# Altium schematic sheet 7segment.SchDoc: 7 szegmens kijelzők
size A4; Author: Debreczeni László; Organization: BME-AUT; DocumentNumber: 2; Revision: A27; SheetNumber: 2; SheetTotal: 5
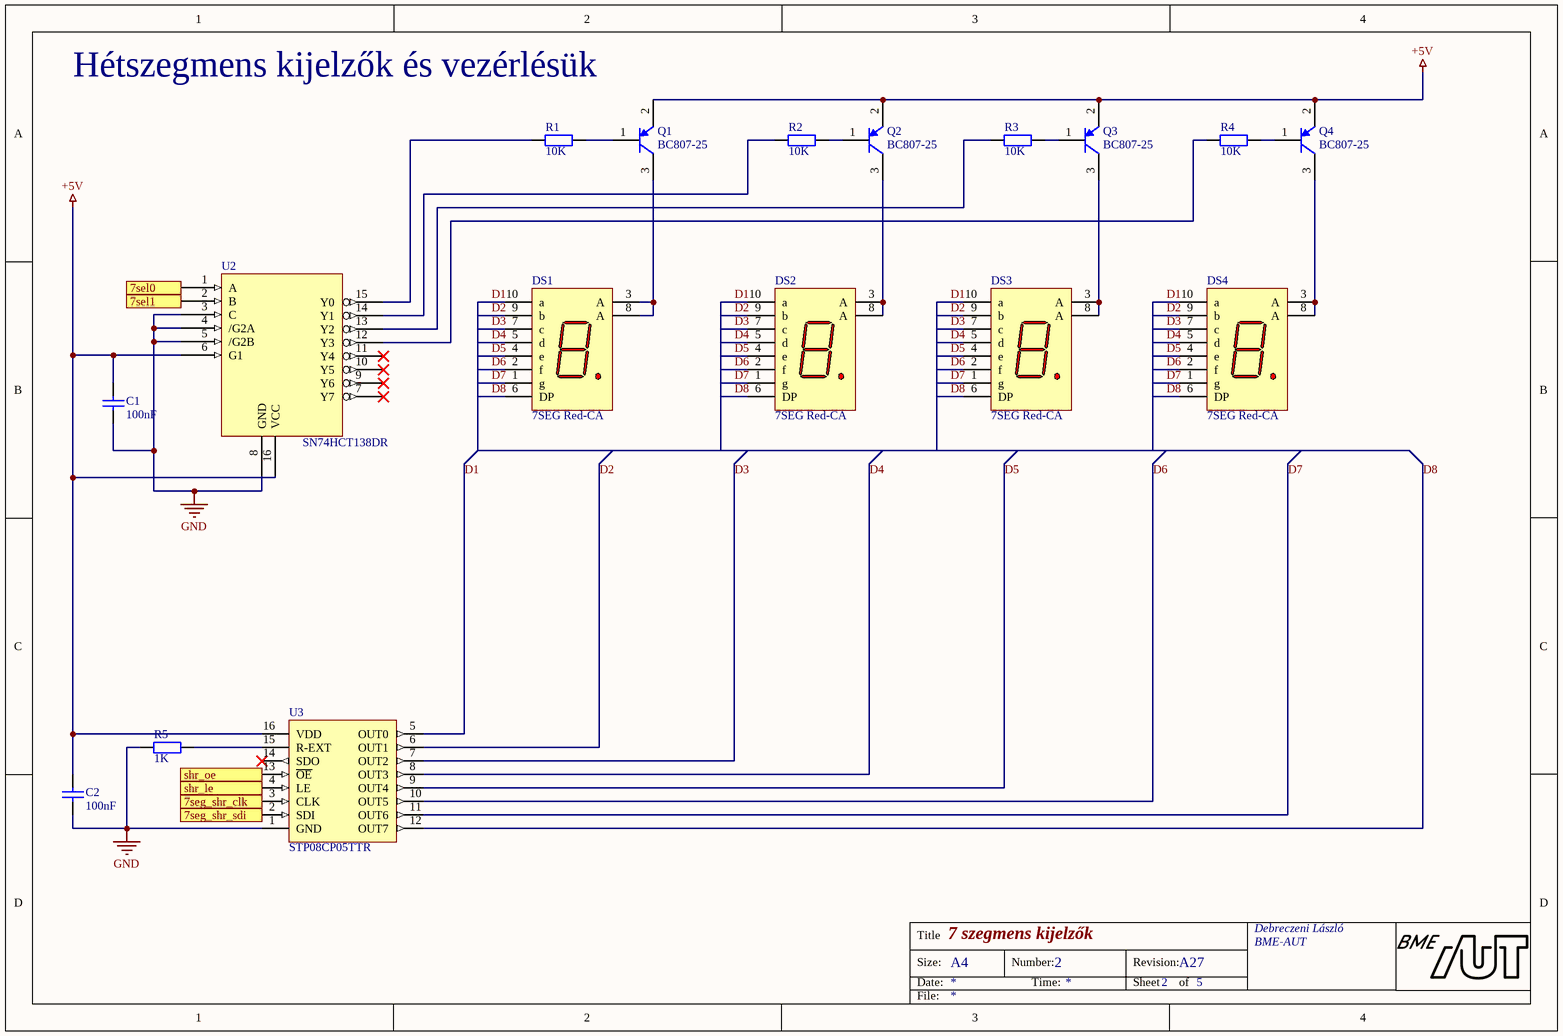
[diagram p0: 7segment.SchDoc]

## Parts
C1  100nF  [FP_1206_CAP_125]
C2  100nF  [FP_1206_CAP_125]
DS1  7SEG Red-CA  [FP_7SEG]
DS2  7SEG Red-CA  [FP_7SEG]
DS3  7SEG Red-CA  [FP_7SEG]
DS4  7SEG Red-CA  [FP_7SEG]
Q1  BC807-25  [SOT95P240X115-3M]
Q2  BC807-25  [SOT95P240X115-3M]
Q3  BC807-25  [SOT95P240X115-3M]
Q4  BC807-25  [SOT95P240X115-3M]
R1  10K  [FP_1206_RES]
R2  10K  [FP_1206_RES]
R3  10K  [FP_1206_RES]
R4  10K  [FP_1206_RES]
R5  1K  [FP_1206_RES]
U2  SN74HCT138DR  [SOIC127P600X175-16M]
U3  STP08CP05TTR  [TSOP65P640X120-16M]

## Ports
7seg_shr_clk (in), 7seg_shr_sdi (in), 7sel0 (in), 7sel1 (in), shr_le (in), shr_oe (in)

## Nets
+5V: C1.2 C2.2 Q1.2(E) Q2.2(E) Q3.2(E) Q4.2(E) U2.6(G1) U2.16(VCC) U3.16(VDD)
GND: C1.1 C2.1 R5.1 U2.3(C) U2.4(/G2A) U2.5(/G2B) U2.8(GND) U3.1(GND)
7seg_shr_clk: U3.3(CLK) ; port 7seg_shr_clk
7seg_shr_sdi: U3.2(SDI) ; port 7seg_shr_sdi
7sel0: U2.1(A) ; port 7sel0
7sel1: U2.2(B) ; port 7sel1
D1: DS1.10(a) DS2.10(a) DS3.10(a) DS4.10(a) U3.5(OUT0)
D2: DS1.9(b) DS2.9(b) DS3.9(b) DS4.9(b) U3.6(OUT1)
D3: DS1.7(c) DS2.7(c) DS3.7(c) DS4.7(c) U3.7(OUT2)
D4: DS1.5(d) DS2.5(d) DS3.5(d) DS4.5(d) U3.8(OUT3)
D5: DS1.4(e) DS2.4(e) DS3.4(e) DS4.4(e) U3.9(OUT4)
D6: DS1.2(f) DS2.2(f) DS3.2(f) DS4.2(f) U3.10(OUT5)
D7: DS1.1(g) DS2.1(g) DS3.1(g) DS4.1(g) U3.11(OUT6)
D8: DS1.6(DP) DS2.6(DP) DS3.6(DP) DS4.6(DP) U3.12(OUT7)
shr_le: U3.4(LE) ; port shr_le
shr_oe: U3.13(~{OE}) ; port shr_oe
NetDS1_3: DS1.3(A) DS1.8(A) Q1.3(C)
NetDS2_3: DS2.3(A) DS2.8(A) Q2.3(C)
NetDS3_3: DS3.3(A) DS3.8(A) Q3.3(C)
NetDS4_3: DS4.3(A) DS4.8(A) Q4.3(C)
NetQ1_1: Q1.1(B) R1.2
NetQ2_1: Q2.1(B) R2.2
NetQ3_1: Q3.1(B) R3.2
NetQ4_1: Q4.1(B) R4.2
NetR1_1: R1.1 U2.15(Y0)
NetR2_1: R2.1 U2.14(Y1)
NetR3_1: R3.1 U2.13(Y2)
NetR4_1: R4.1 U2.12(Y3)
NetR5_2: R5.2 U3.15(R-EXT)

Not connected (* = marked no-connect by the designer): U2 7(Y7)* 9(Y6)* 10(Y5)* 11(Y4)*; U3 14(SDO)*

## Notes on the sheet
- Hétszegmens kijelzők és vezérlésük
- Title
- Size:
- Date:
- A4
- Number:
- Time:
- Revision:
- Sheet
- of
- File:

## Library data of the parts
C1 C2 = CAP: Capacitor; Tolerance: 10%; Voltage: 50V; Name: 100nF 1206 Capacitor; Supplier: Lomex; Reference: 82-14-64; Value: 100nF
DS1-DS4 = 7SEG Red-CA: 7-Segment Display: CA, RH DP; MinimumIntensity: 360 ucd; Note: IF = 5 mA; Colour: High Efficiency Red (HER); Note: Pins 1 and 6 are redundant Anodes.; Name: FYS-3911BUHR-21; Published: 8-Jun-2000; LatestRevisionDate: 17-Dec-2003; LatestRevisionNote: Schematic revised, PCB Footprint replaced.; DatasheetVersion: 19-Feb-2002; PackageVersion: 11-Feb-2002; PackageReference: A; Publisher: Altium Limited; PackageDescription: LED, 7-Segment Display, 7.62 mm, RHD; 10 Leads; Row Space 5.08 mm; Pitch 2.54 mm; ComponentLink1Description: Manufacturer Link; ComponentLink1URL: http://www.agilent.com/; Supplier: Lomex; Reference: 35-03-94
Q1-Q4 = BC807-25: PNP General-purpose Transistor; Supplier: Lomex; Reference: 86-05-63; Name: BC807-25
R1-R4 = RES: Resistor; Tolerance: 5%; Power: 0.25W; Name: 10K 1206 Resistor; Supplier: Lomex; Reference: 81-11-59; Value: 10K
R5 = RES: Resistor; Tolerance: 5%; Power: 0.25W; Name: 1K 1206 Resistor; Supplier: Lomex; Reference: 81-11-47; Value: 1K
U2 = SN74HCT138DR: 3-line to 8-line decoder; Supplier: Lomex; Reference: 87-06-49; Name: SN74HCT138DR
U3 = STP08CP05TTR: Low voltage, low current power 8-bit shift register; Supplier: ST, Tanszéki forrás; Name: STP08CP05TTR